# EAGLE schematic u16_zxbus_rev_a (EAGLE 6.4)
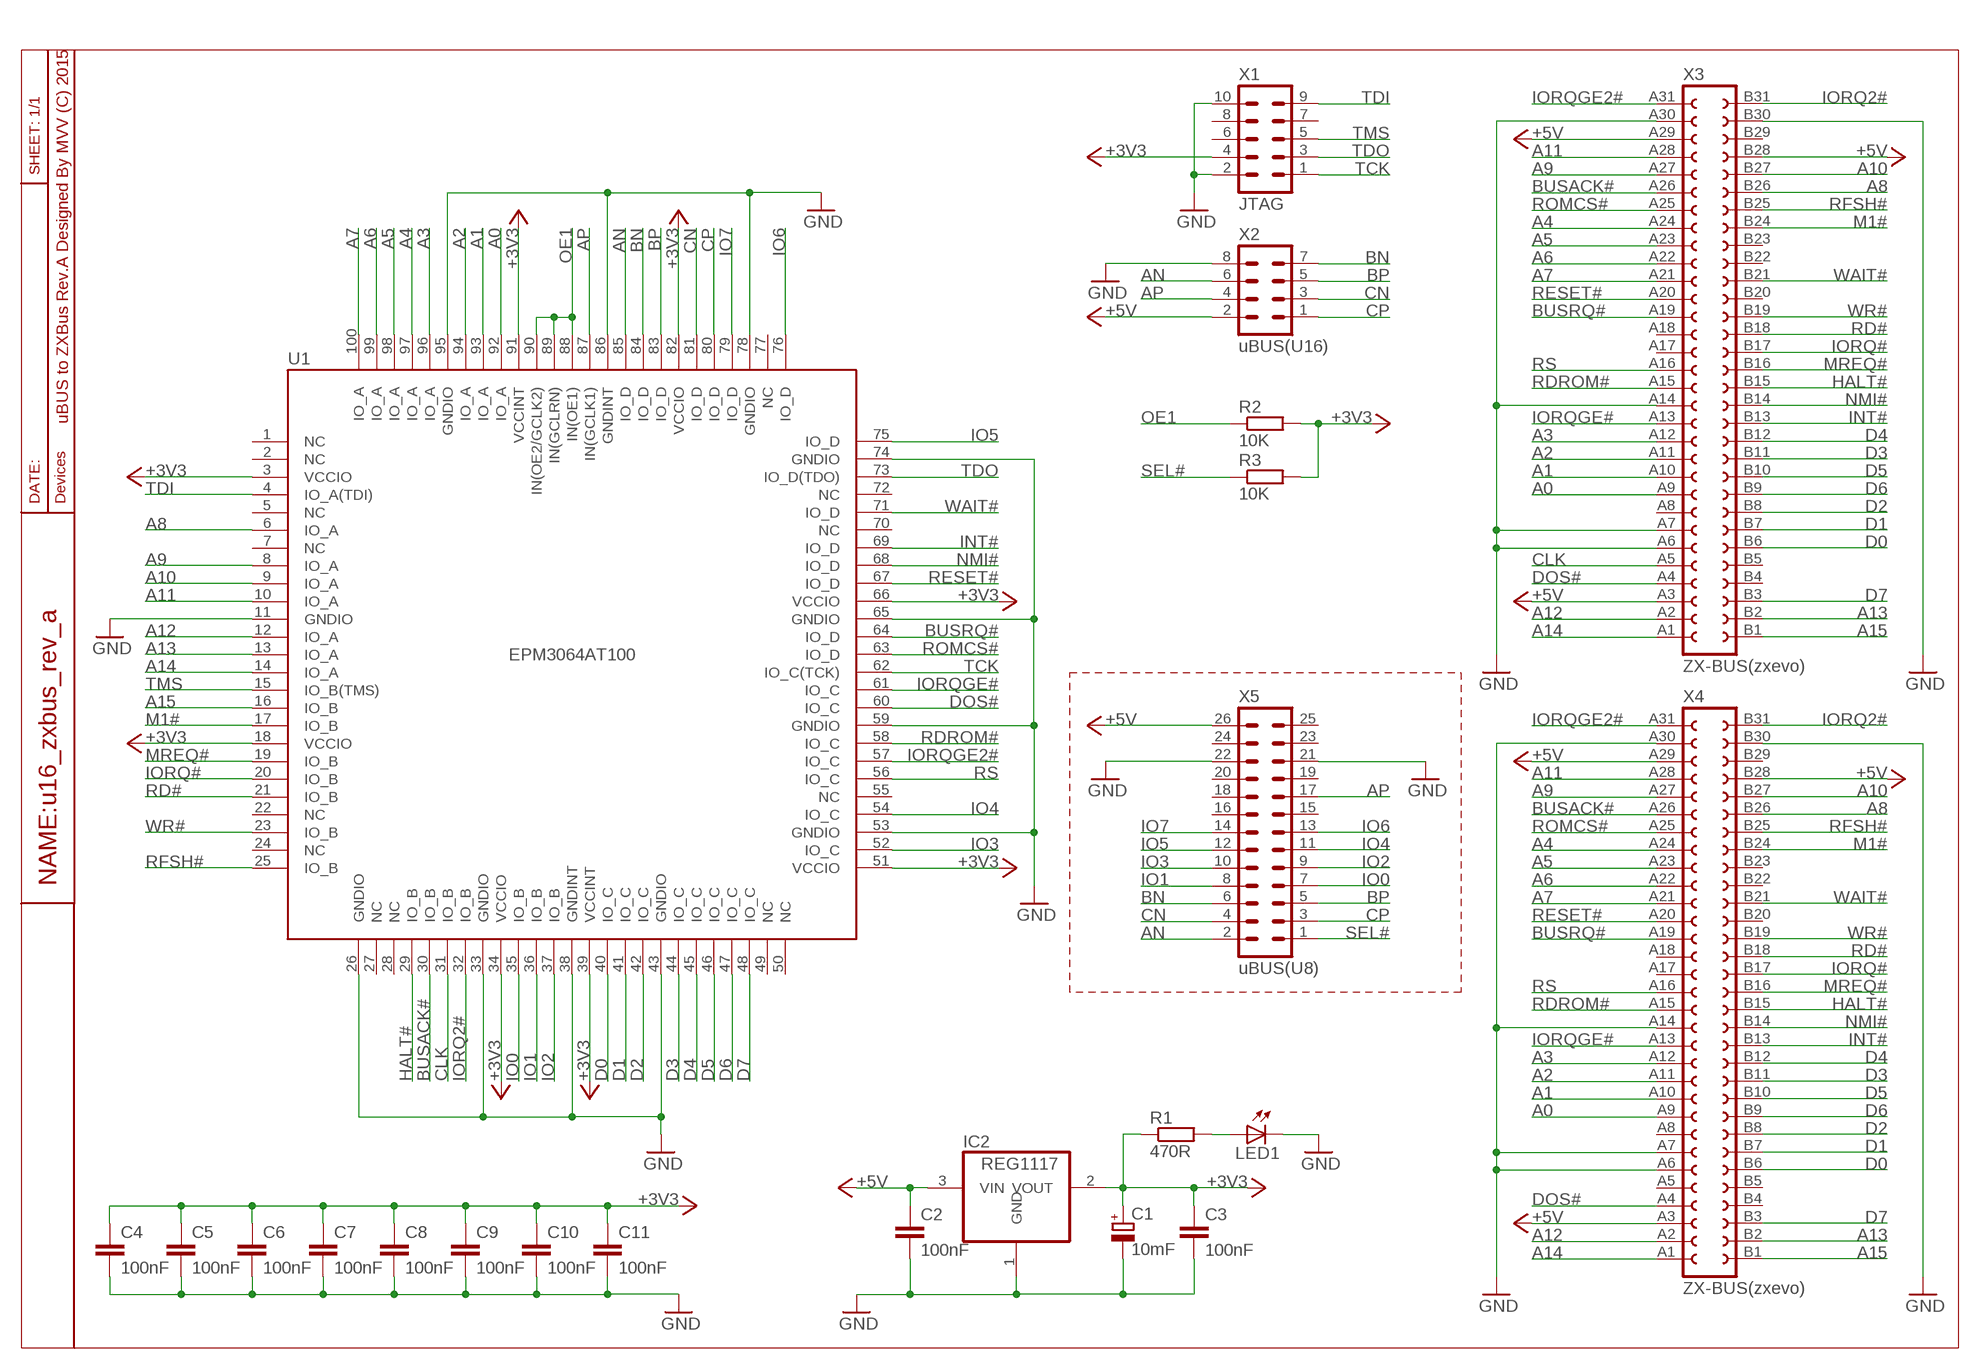
[diagram p0: schematic, sheet 1]

## Parts
C1  10mF  CPOL-EUCT6032  [CT6032]
C2  100nF  C-EUC0805  [C0805]
C3  100nF  C-EUC0805  [C0805]
C4  100nF  C-EUC0805  [C0805]
C5  100nF  C-EUC0805  [C0805]
C6  100nF  C-EUC0805  [C0805]
C7  100nF  C-EUC0805  [C0805]
C8  100nF  C-EUC0805  [C0805]
C9  100nF  C-EUC0805  [C0805]
C10  100nF  C-EUC0805  [C0805]
C11  100nF  C-EUC0805  [C0805]
IC2  REG1117  [SOT223]
LED1  LEDCHIPLED_0805  [CHIPLED_0805]
R1  470R  R-EU_R0805  [R0805]
R2  10K  R-EU_R0805  [R0805]
R3  10K  R-EU_R0805  [R0805]
U1  EPM3064AT100  [TQFP100]
X1  JTAG  ML10  [ML10]
X2  uBUS(U16)  MA04-2  [MA04-2]
X3  ZX-BUS(zxevo)  FE31-2  [FE31-2]
X4  ZX-BUS(zxevo)  ESO3101  [ESO3101]
X5  uBUS(U8)  ML26  [ML26]

## Nets
+3V3: C1.+ C3.1 C4.1 C5.1 C6.1 C7.1 C8.1 C9.1 C10.1 C11.1 IC2.2(VOUT) R1.1 R2.2 R3.2 U1.3(VCCIO) U1.18(VCCIO) U1.34(VCCIO) U1.39(VCCINT) U1.51(VCCIO) U1.66(VCCIO) U1.82(VCCIO) U1.91(VCCINT) X1.4
+5V: C2.1 IC2.3(VIN) X2.2 X3.A3 X3.A29 X3.B28 X4.A3 X4.A29 X4.B28 X5.26
A0: U1.92(IO_A) X3.A9 X4.A9
A1: U1.93(IO_A) X3.A10 X4.A10
A2: U1.94(IO_A) X3.A11 X4.A11
A3: U1.96(IO_A) X3.A12 X4.A12
A4: U1.97(IO_A) X3.A24 X4.A24
A5: U1.98(IO_A) X3.A23 X4.A23
A6: U1.99(IO_A) X3.A22 X4.A22
A7: U1.100(IO_A) X3.A21 X4.A21
A8: U1.6(IO_A) X3.B26 X4.B26
A9: U1.8(IO_A) X3.A27 X4.A27
A10: U1.9(IO_A) X3.B27 X4.B27
A11: U1.10(IO_A) X3.A28 X4.A28
A12: U1.12(IO_A) X3.A2 X4.A2
A13: U1.13(IO_A) X3.B2 X4.B2
A14: U1.14(IO_A) X3.A1 X4.A1
A15: U1.16(IO_B) X3.B1 X4.B1
AN: U1.85(IO_D) X2.6 X5.2
AP: U1.87(IN(GCLK1)) X2.4 X5.17
BN: U1.84(IO_D) X2.7 X5.6
BP: U1.83(IO_D) X2.5 X5.5
BUSACK#: U1.30(IO_B) X3.A26 X4.A26
BUSRQ#: U1.64(IO_D) X3.A19 X4.A19
CLK: U1.31(IO_B) X3.A5
CN: U1.81(IO_D) X2.3 X5.4
CP: U1.80(IO_D) X2.1 X5.3
D0: U1.40(IO_C) X3.B6 X4.B6
D1: U1.41(IO_C) X3.B7 X4.B7
D2: U1.42(IO_C) X3.B8 X4.B8
D3: U1.44(IO_C) X3.B11 X4.B11
D4: U1.45(IO_C) X3.B12 X4.B12
D5: U1.46(IO_C) X3.B10 X4.B10
D6: U1.47(IO_C) X3.B9 X4.B9
D7: U1.48(IO_C) X3.B3 X4.B3
DOS#: U1.60(IO_C) X3.A4 X4.A4
GND: C1.- C2.2 C3.2 C4.2 C5.2 C6.2 C7.2 C8.2 C9.2 C10.2 C11.2 IC2.1(GND) LED1.C U1.11(GNDIO) U1.26(GNDIO) U1.33(GNDIO) U1.38(GNDINT) U1.43(GNDIO) U1.53(GNDIO) U1.59(GNDIO) U1.65(GNDIO) U1.74(GNDIO) U1.78(GNDIO) U1.86(GNDINT) U1.95(GNDIO) X1.2 X1.10 X2.8 X3.A6 X3.A7 X3.A14 X3.A30 X3.B30 X4.A6 X4.A7 X4.A14 X4.A30 X4.B30 X5.21 X5.22
HALT#: U1.29(IO_B) X3.B15 X4.B15
INT#: U1.69(IO_D) X3.B13 X4.B13
IO0: U1.35(IO_B) X5.7
IO1: U1.36(IO_B) X5.8
IO2: U1.37(IO_B) X5.9
IO3: U1.52(IO_C) X5.10
IO4: U1.54(IO_C) X5.11
IO5: U1.75(IO_D) X5.12
IO6: U1.76(IO_D) X5.13
IO7: U1.79(IO_D) X5.14
IORQ2#: U1.32(IO_B) X3.B31 X4.B31
IORQ#: U1.20(IO_B) X3.B17 X4.B17
IORQGE2#: U1.57(IO_C) X3.A31 X4.A31
IORQGE#: U1.61(IO_C) X3.A13 X4.A13
M1#: U1.17(IO_B) X3.B24 X4.B24
MREQ#: U1.19(IO_B) X3.B16 X4.B16
N$12: LED1.A R1.2
NMI#: U1.68(IO_D) X3.B14 X4.B14
OE1: R2.1 U1.88(IN(OE1)) U1.89(IN(GCLRN)) U1.90(IN(OE2/GCLK2))
RD#: U1.21(IO_B) X3.B18 X4.B18
RDROM#: U1.58(IO_C) X3.A15 X4.A15
RESET#: U1.67(IO_D) X3.A20 X4.A20
RFSH#: U1.25(IO_B) X3.B25 X4.B25
ROMCS#: U1.63(IO_D) X3.A25 X4.A25
RS: U1.56(IO_C) X3.A16 X4.A16
SEL#: R3.1 X5.1
TCK: U1.62(IO_C(TCK)) X1.1
TDI: U1.4(IO_A(TDI)) X1.9
TDO: U1.73(IO_D(TDO)) X1.3
TMS: U1.15(IO_B(TMS)) X1.5
WAIT#: U1.71(IO_D) X3.B21 X4.B21
WR#: U1.23(IO_B) X3.B19 X4.B19
Unconnected: U1.1(NC) U1.2(NC) U1.5(NC) U1.7(NC) U1.22(NC) U1.24(NC) U1.27(NC) U1.28(NC) U1.49(NC) U1.50(NC) U1.55(NC) U1.70(NC) U1.72(NC) U1.77(NC) X1.6 X1.7 X1.8 X3.A8 X3.A17 X3.A18 X3.B4 X3.B5 X3.B20 X3.B22 X3.B23 X3.B29 X4.A5 X4.A8 X4.A17 X4.A18 X4.B4 X4.B5 X4.B20 X4.B22 X4.B23 X4.B29 X5.15 X5.16 X5.18 X5.19 X5.20 X5.23 X5.24 X5.25

## Notes on the sheet
- uBUS to ZXBus Rev.A Designed By MVV (C) 2015

## Library data of the parts
C1 = rcl:CPOL-EU: POLARIZED CAPACITOR, European symbol
C2-C11 = rcl:C-EU: CAPACITOR, European symbol
IC2 = burr-brown:REG1117: 800mA and 1A Low Dropout (LDO) Positive Regulator 1.8V, 2.5V, 2.85V, 3.3V, 5V, and Adj; MPN: REG1117; OC_FARNELL: 1097566; OC_NEWARK: 14P6981
LED1 = led:LED: LED OSRAM: - CHIPLED LG R971, LG N971, LY N971, LG Q971, LY Q971, LO R971, LY R971 LH N974, LH R974 LS Q976, LO Q976, LY Q976 LO Q996 - Hyper CHIPLED LW Q18S LB Q993, LB Q99A, LB R99A - SideLED LS A670, LO A670, LY A670, LG A670, LP A670 LB A673, LV A673, LT A673, LW A673 LH A674 LY A675 LS A676, LA A676, LO A676, LY A676, LW A676 LS A679, LY A679, LG A679 - Hyper Micro SIDELED® LS Y876, LA Y876, LO Y876, LY Y876 LT Y87S - SmartLED LW L88C, LW L88S LB L89C, LB L89S, LG L890 LS L89K, LO L89K, LY L89K LS L896, LA L896, LO L896, LY L896 - TOPLED LS T670, LO T670, LY T670, LG T670, LP T670 LSG T670, LSP T670, LSY T670, LOP T670, LYG T670 LG T671, LOG T671, LSG T671 LB T673, LV T673, LT T673, LW T673 LH T674 LS T676, LA T676, LO T676, LY T676, LB T676, LH T676, LSB T676, LW T676 LB T67C, LV T67C, LT T67C, LS T67K, LO T67K, LY T67K, LW E67C LS E67B, LA E67B, LO E67B, LY E67B, LB E67C, LV E67C, LT E67C LW T67C LS T679, LY T679, LG T679 LS T770, LO T770, LY T770, LG T770, LP T770 LB T773, LV T773, LT T773, LW T773 LH T774 LS E675, LA E675, LY E675, LS T675 LS T776, LA T776, LO T776, LY T776, LB T776 LHGB T686 LT T68C, LB T68C - Hyper Mini TOPLED® LB M676 - Mini TOPLED Santana® LG M470 LS M47K, LO M47K, LY M47K Source: http://www.osram.convergy.de LUXEON: - LUMILED® LXK2-PW12-R00, LXK2-PW12-S00, LXK2-PW14-U00, LXK2-PW14-V00 LXK2-PM12-R00, LXK2-PM12-S00, LXK2-PM14-U00 LXK2-PE12-Q00, LXK2-PE12-R00, LXK2-PE12-S00, LXK2-PE14-T00, LXK2-PE14-U00 LXK2-PB12-K00, LXK2-PB12-L00, LXK2-PB12-M00, LXK2-PB14-N00, LXK2-PB14-P00, LXK2-PB14-Q00 LXK2-PR12-L00, LXK2-PR12-M00, LXK2-PR14-Q00, LXK2-PR14-R00 LXK2-PD12-Q00, LXK2-PD12-R00, LXK2-PD12-S00 LXK2-PH12-R00, LXK2-PH12-S00 LXK2-PL12-P00, LXK2-PL12-Q00, LXK2-PL12-R00 Source: www.luxeon.com KINGBRIGHT: KA-3528ASYC Source: www.kingbright.com
R1-R3 = rcl:R-EU_: RESISTOR, European symbol
U1 = altera:EPM3064AT100
X1 = con-ml:ML10: HARTING
X2 = con-lstb:MA04-2: PIN HEADER; OC_FARNELL: unknown; OC_NEWARK: unknown
X3 = con-lsta:FE31-2
X4 = con-lsta:ESO3101
X5 = con-ml:ML26: HARTING